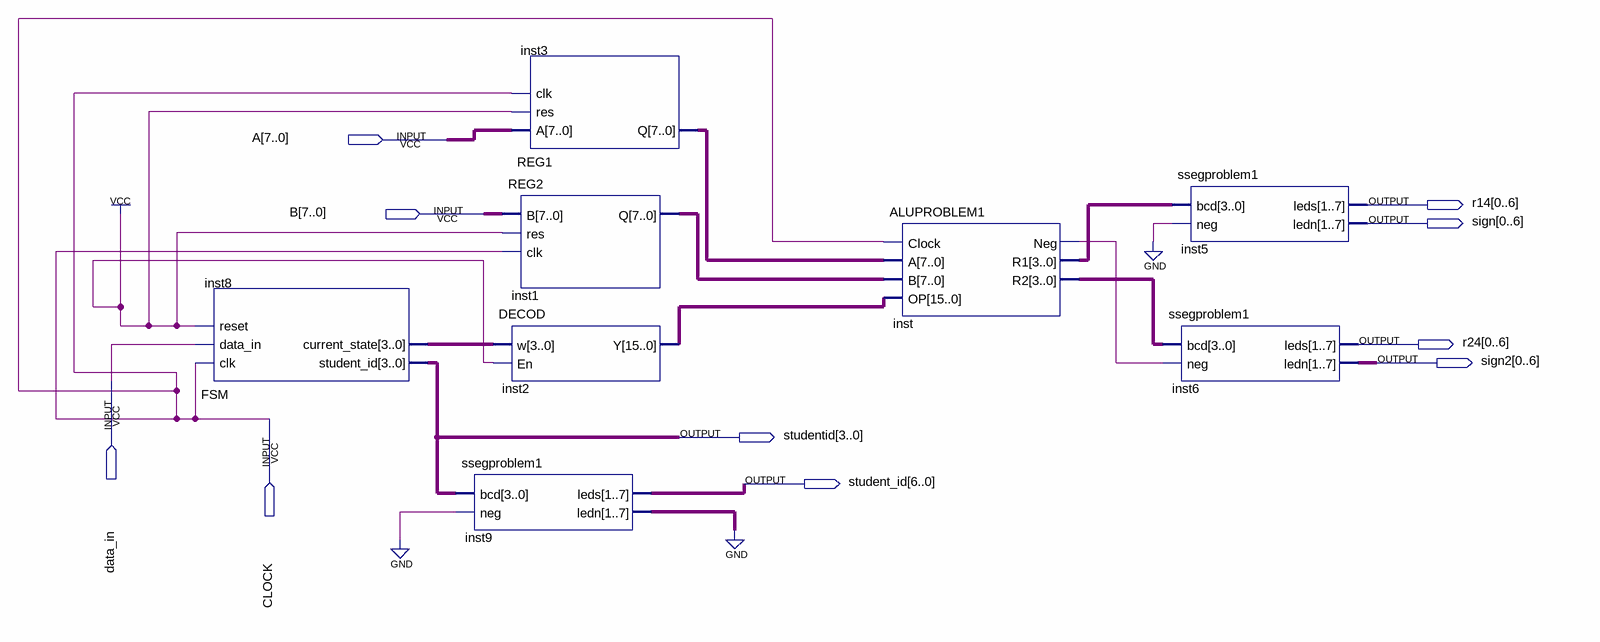
[diagram p0: schematic sheet]
// Quartus schematic PROBLEM1.bdf as structural Verilog: 8 symbols, 10 pins
module PROBLEM1 (
  input  [7:0] A,
  input  [7:0] B,
  input  data_in,
  input  CLOCK,
  output [0:6] r14,
  output [0:6] sign,
  output [0:6] r24,
  output [0:6] sign2,
  output [3:0] studentid,
  output [6:0] student_id
);

  wire inst_neg;
  wire [3:0] inst8_current_state, inst_r1, inst_r2;
  wire [6:0] inst9_ledn;
  wire [7:0] inst1_q, inst3_q;
  wire [15:0] inst2_y;

  FSM inst8 (.clk(CLOCK), .data_in(data_in), .reset(1'b1), .student_id(studentid), .current_state(inst8_current_state));
  REG1 inst3 (.A(A), .res(1'b1), .clk(CLOCK), .Q(inst3_q));
  REG2 inst1 (.B(B), .res(1'b1), .clk(CLOCK), .Q(inst1_q));
  DECOD inst2 (.w(inst8_current_state), .En(1'b1), .Y(inst2_y));
  ssegproblem1 inst9 (.bcd(studentid), .neg(1'b0), .leds(student_id), .ledn(inst9_ledn));
  ALUPROBLEM1 inst (.Clock(CLOCK), .A(inst3_q), .B(inst1_q), .OP(inst2_y), .Neg(inst_neg), .R1(inst_r1), .R2(inst_r2));
  ssegproblem1 inst5 (.bcd(inst_r1), .neg(1'b0), .leds(r14), .ledn(sign));
  ssegproblem1 inst6 (.bcd(inst_r2), .neg(inst_neg), .leds(r24), .ledn(sign2));
  // also tied to GND on the sheet: {inst9_ledn[0], inst9_ledn[1], inst9_ledn[2], inst9_ledn[3], inst9_ledn[4], inst9_ledn[5], inst9_ledn[6]}
endmodule
